# Altium schematic sheet CORE.SchDoc
size A4
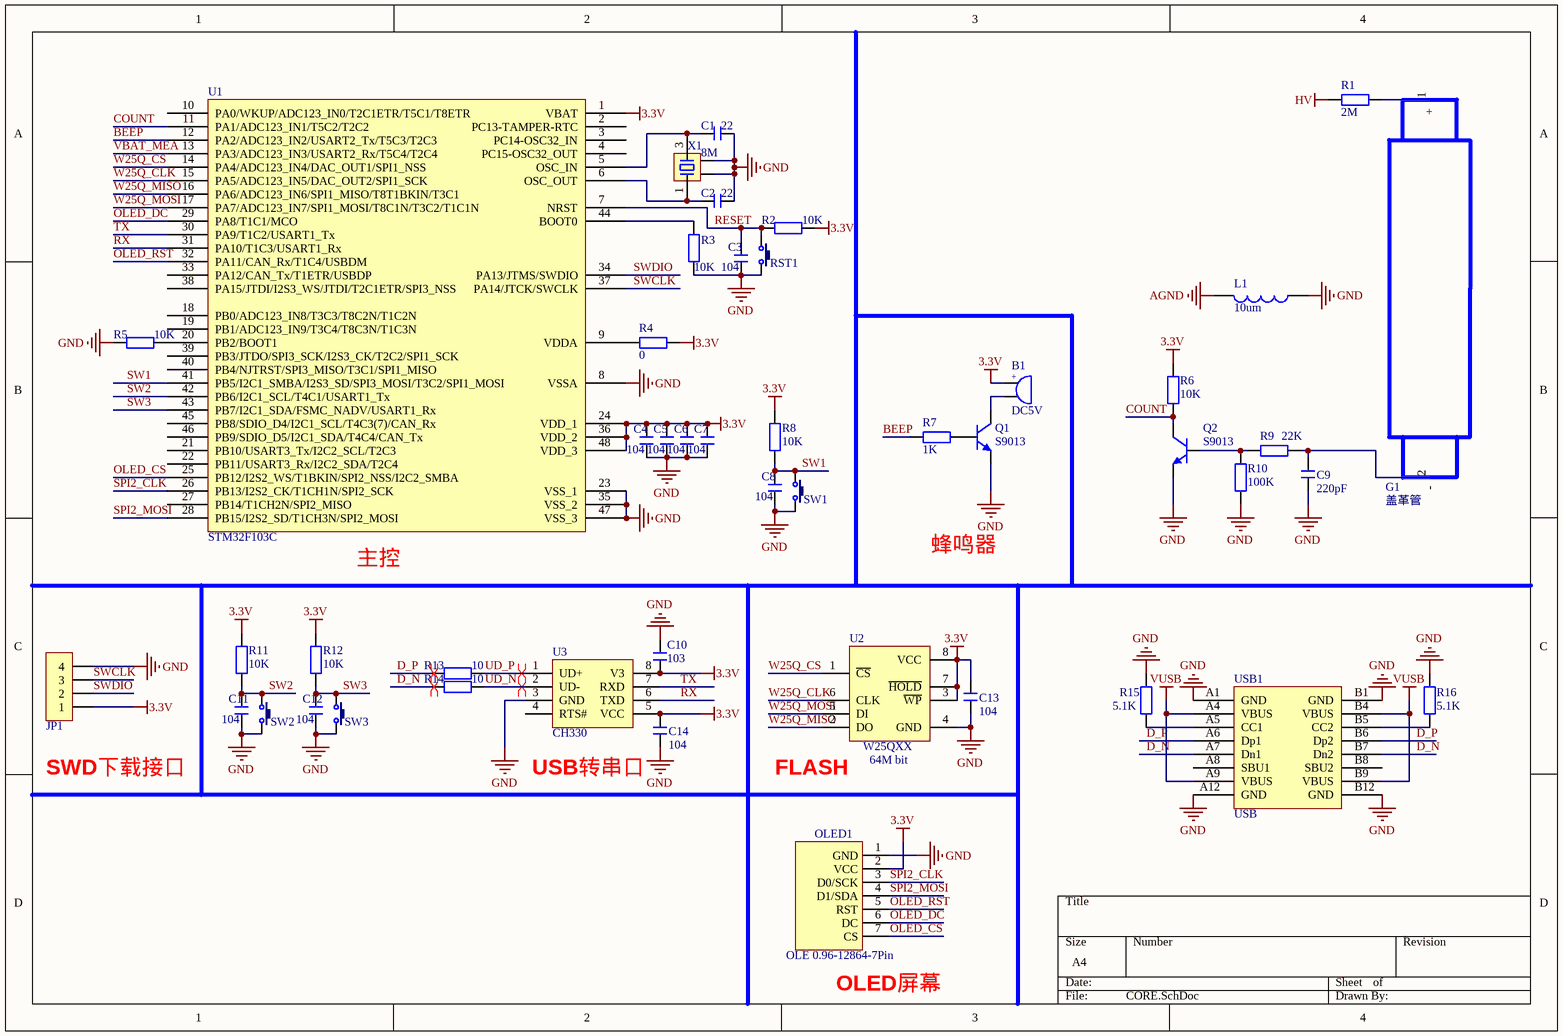
[diagram p0: CORE.SchDoc]

## Parts
B1  DC5V  [BEEP 5x9x5.5]
C1  22  [C 0603]
C2  22  [C 0603]
C3  104  [C 0603]
C4  104  [C 0603]
C5  104  [C 0603]
C6  104  [C 0603]
C7  104  [C 0603]
C8  104  [C 0603]
C9  220pF  [C 0603]
C10  103  [C 0603]
C11  104  [C 0603]
C12  104  [C 0603]
C13  104  [C 0603]
C14  104  [C 0603]
G1  盖革管  [SI3BG 2]
JP1  HDR-1X4  [SH1.0-4P-L]  (value not drawn)
L1  10um  [L 0805]
OLED1  OLE 0.96-12864-7Pin  [HDR-1X7_M]
Q1  S9013  [SOT23-3N]
Q2  S9013  [SOT23-3N]
R1  2M  [R 0603]
R2  10K  [R 0603]
R3  10K  [R 0603]
R4  0  [R 0603]
R5  10K  [R 0603]
R6  10K  [R 0603]
R7  1K  [R 0603]
R8  10K  [R 0603]
R9  22K  [R 0603]
R10  100K  [R 0603]
R11  10K  [R 0603]
R12  10K  [R 0603]
R13  10  [R 0603]
R14  10  [R 0603]
R15  5.1K  [R 0603]
R16  5.1K  [R 0603]
RST1  TSW  [TSW 2*4*3.5-S-W]  (value not drawn)
SW1  TSW  [TSW 2*4*3.5-S-W]  (value not drawn)
SW2  TSW  [TSW 2*4*3.5-S-W]  (value not drawn)
SW3  TSW  [TSW 2*4*3.5-S-W]  (value not drawn)
U1  STM32F103C  [LQFP-48_M]
U2  W25QXX  Memory: 64M bit  [SOIC8_W]
U3  CH330  [SOIC8_N]
USB1  USB  [USB-C/16P]
X1  8M  [XTAL-3225]

## Nets
3.3V: B1.1 C4.2 C5.2 C6.2 C7.2 C10.1 C13.2 C14.2 JP1.1 OLED1.2(VCC) R2.1 R4.1 R6.2 R8.1 R11.1 R12.1 U1.1(VBAT) U1.24(VDD_1) U1.36(VDD_2) U1.48(VDD_3) U2.3(~{WP}) U2.7(~{HOLD}) U2.8(VCC) U3.5(VCC) U3.8(V3)
AGND: L1.2
GND: C1.2 C2.2 C3.1 C4.1 C5.1 C6.1 C7.1 C8.1 C9.1 C10.2 C11.1 C12.1 C13.1 C14.1 JP1.4 L1.1 OLED1.1(GND) Q1.2(E) Q2.2(E) R3.1 R5.2 R10.1 R15.2 R16.2 RST1.1 SW1.1 SW2.1 SW3.1 U1.8(VSSA) U1.23(VSS_1) U1.35(VSS_2) U1.47(VSS_3) U2.4(GND) U3.3(GND) USB1.A1(GND) USB1.A12(GND) USB1.B1(GND) USB1.B12(GND) X1.2 X1.4
HV: R1.1
VUSB: USB1.A4(VBUS) USB1.A9(VBUS) USB1.B4(VBUS) USB1.B9(VBUS)
BEEP: R7.2 U1.12(PA2/ADC123_IN2/USART2_Tx/T5C3/T2C3)
COUNT: Q2.3(C) R6.1 U1.11(PA1/ADC123_IN1/T5C2/T2C2)
D_N: R14.1 USB1.A7(Dn1) USB1.B7(Dn2)
D_P: R13.1 USB1.A6(Dp1) USB1.B6(Dp2)
OLED_CS: OLED1.7(CS) U1.25(PB12/I2S2_WS/T1BKIN/SPI2_NSS/I2C2_SMBA)
OLED_DC: OLED1.6(DC) U1.29(PA8/T1C1/MCO)
OLED_RST: OLED1.5(RST) U1.32(PA11/CAN_Rx/T1C4/USBDM)
RESET: C3.2 R2.2 RST1.2 U1.7(NRST)
RX: U1.31(PA10/T1C3/USART1_Rx) U3.6(TXD)
SPI2_CLK: OLED1.3(D0/SCK) U1.26(PB13/I2S2_CK/T1CH1N/SPI2_SCK)
SPI2_MOSI: OLED1.4(D1/SDA) U1.28(PB15/I2S2_SD/T1CH3N/SPI2_MOSI)
SW1: C8.2 R8.2 SW1.2 U1.41(PB5/I2C1_SMBA/I2S3_SD/SPI3_MOSI/T3C2/SPI1_MOSI)
SW2: C11.2 R11.2 SW2.2 U1.42(PB6/I2C1_SCL/T4C1/USART1_Tx)
SW3: C12.2 R12.2 SW3.2 U1.43(PB7/I2C1_SDA/FSMC_NADV/USART1_Rx)
SWCLK: JP1.3 U1.37(PA14/JTCK/SWCLK)
SWDIO: JP1.2 U1.34(PA13/JTMS/SWDIO)
TX: U1.30(PA9/T1C2/USART1_Tx) U3.7(RXD)
UD_N: R14.2 U3.2(UD-)
UD_P: R13.2 U3.1(UD+)
VBAT_MEA: U1.13(PA3/ADC123_IN3/USART2_Rx/T5C4/T2C4)
W25Q_CLK: U1.15(PA5/ADC123_IN5/DAC_OUT2/SPI1_SCK) U2.6(CLK)
W25Q_CS: U1.14(PA4/ADC123_IN4/DAC_OUT1/SPI1_NSS) U2.1(~{CS})
W25Q_MISO: U1.16(PA6/ADC123_IN6/SPI1_MISO/T8T1BKIN/T3C1) U2.2(DO)
W25Q_MOSI: U1.17(PA7/ADC123_IN7/SPI1_MOSI/T8C1N/T3C2/T1C1N) U2.5(DI)
NetB1_2: B1.2 Q1.3(C)
NetC1_1: C1.1 U1.5(OSC_IN) X1.3
NetC2_1: C2.1 U1.6(OSC_OUT) X1.1
NetC9_2: C9.2 G1.2(-) R9.1
NetG1_1: G1.1(+) R1.2
NetQ1_1: Q1.1(B) R7.1
NetQ2_1: Q2.1(B) R9.2 R10.2
NetR3_2: R3.2 U1.44(BOOT0)
NetR4_2: R4.2 U1.9(VDDA)
NetR5_1: R5.1 U1.20(PB2/BOOT1)
NetR15_1: R15.1 USB1.A5(CC1)
NetR16_1: R16.1 USB1.B5(CC2)

Not connected (* = marked no-connect by the designer): U1 2(PC13-TAMPER-RTC) 3(PC14-OSC32_IN) 4(PC15-OSC32_OUT) 10(PA0/WKUP/ADC123_IN0/T2C1ETR/T5C1/T8ETR) 18(PB0/ADC123_IN8/T3C3/T8C2N/T1C2N) 19(PB1/ADC123_IN9/T3C4/T8C3N/T1C3N) 21(PB10/USART3_Tx/I2C2_SCL/T2C3) 22(PB11/USART3_Rx/I2C2_SDA/T2C4) 27(PB14/T1CH2N/SPI2_MISO) 33(PA12/CAN_Tx/T1ETR/USBDP) 38(PA15/JTDI/I2S3_WS/JTDI/T2C1ETR/SPI3_NSS) 39(PB3/JTDO/SPI3_SCK/I2S3_CK/T2C2/SPI1_SCK) 40(PB4/NJTRST/SPI3_MISO/T3C1/SPI1_MISO) 45(PB8/SDIO_D4/I2C1_SCL/T4C3(7)/CAN_Rx) 46(PB9/SDIO_D5/I2C1_SDA/T4C4/CAN_Tx); U3 4(RTS#); USB1 A8(SBU1) B8(SBU2)

## Layout directives
differential pair: D_N, D_P, UD_N, UD_P

## Notes on the sheet
- (near U1) 主控
- 蜂鸣器
- (near JP1) SWD下载接口
- USB转串口
- (near U2) FLASH
- (near OLED1) OLED屏幕
- (in symbol BEEP) +

## Library data of the parts
B1 = BEEP: 蜂鸣器; 版权归属: 源创客; BOM名称: 蜂鸣器; 学习资源: www.ooocke.com
C1-C14 = C: 无极性贴片电容; 版权归属: 源创客; BOM名称: 无极性贴片电容; 学习资源: www.ooocke.com
G1 = 盖革管: 小型高量程SI3BG GM管
JP1 = Header 4: 4P接插件; 版权归属: 源创客; BOM名称: 4P接插件; 学习资源: www.ooocke.com
L1 = L: 小功率贴片电感; 版权归属: 源创客; BOM名称: 小功率贴片电感; 学习资源: www.ooocke.com
Q1 Q2 = 9013-SMD: 低频放大-NPN型; 版权归属: 源创客; 属性: 50V 0.5A 0.625W; BOM名称: 低频放大-NPN型; 学习资源: www.ooocke.com
R1-R16 = R: 贴片电阻; 版权归属: 源创客; BOM名称: 贴片电阻; 学习资源: www.ooocke.com
RST1 SW1-SW3 = TSW SMD: 轻触开关; BOM名称: 3x6轻触开关; 版权归属: 源创客; 学习资源: www.ooocke.com
U1 = STM32F103C: STM32单片机48引脚
U2 = W25QXX: SPI FLASH
USB1 = USB-C/16P: USB-C型母口16P/12P
X1 = XTAL-4: 4脚晶振; 版权归属: 源创客; BOM名称: 4脚晶振; 学习资源: www.ooocke.com